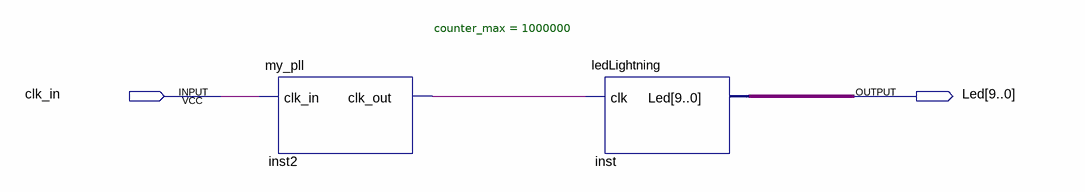
[diagram p0: schematic sheet]
// Quartus schematic lab1.bdf as structural Verilog: 2 symbols, 2 pins
module lab1 (
  input  clk_in,
  output [9:0] Led
);

  wire inst2_clk_out;

  my_pll #(.counter_max(1000000)) inst2 (.clk_in(clk_in), .clk_out(inst2_clk_out));
  ledLightning inst (.clk(inst2_clk_out), .Led(Led));
endmodule
